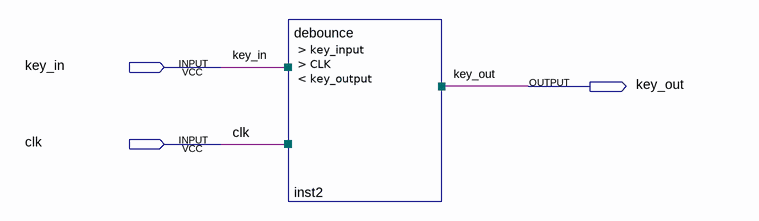
[diagram p0: schematic sheet]
// Quartus schematic debounceProject.bdf as structural Verilog: 1 symbols, 3 pins
module debounceProject (
  input  key_in,
  input  clk,
  output key_out
);

  debounce inst2 (.key_input(key_in), .CLK(clk), .key_output(key_out));
endmodule
